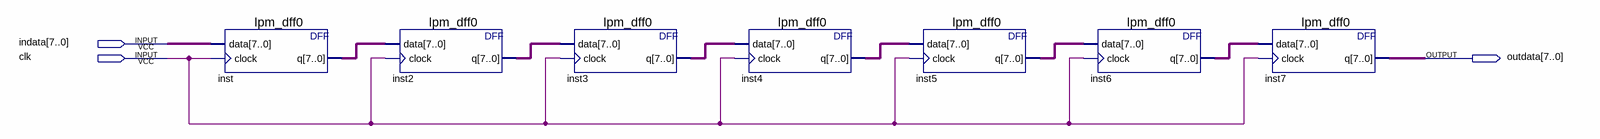
[diagram p0: schematic sheet]
// Quartus schematic buffer.bdf as structural Verilog: 7 symbols, 3 pins
module buffer (
  input  [7:0] indata,
  input  clk,
  output [7:0] outdata
);

  wire [7:0] inst2_q, inst3_q, inst4_q, inst5_q, inst6_q, inst_q;

  lpm_dff0 inst (.data(indata), .clock(clk), .q(inst_q));
  lpm_dff0 inst2 (.data(inst_q), .clock(clk), .q(inst2_q));
  lpm_dff0 inst3 (.data(inst2_q), .clock(clk), .q(inst3_q));
  lpm_dff0 inst4 (.data(inst3_q), .clock(clk), .q(inst4_q));
  lpm_dff0 inst5 (.data(inst4_q), .clock(clk), .q(inst5_q));
  lpm_dff0 inst6 (.data(inst5_q), .clock(clk), .q(inst6_q));
  lpm_dff0 inst7 (.data(inst6_q), .clock(clk), .q(outdata));
endmodule
